# Altium schematic sheet Схема питания Velvet Controller.SchDoc
size A3; SheetNumber: 1; SheetTotal: 6
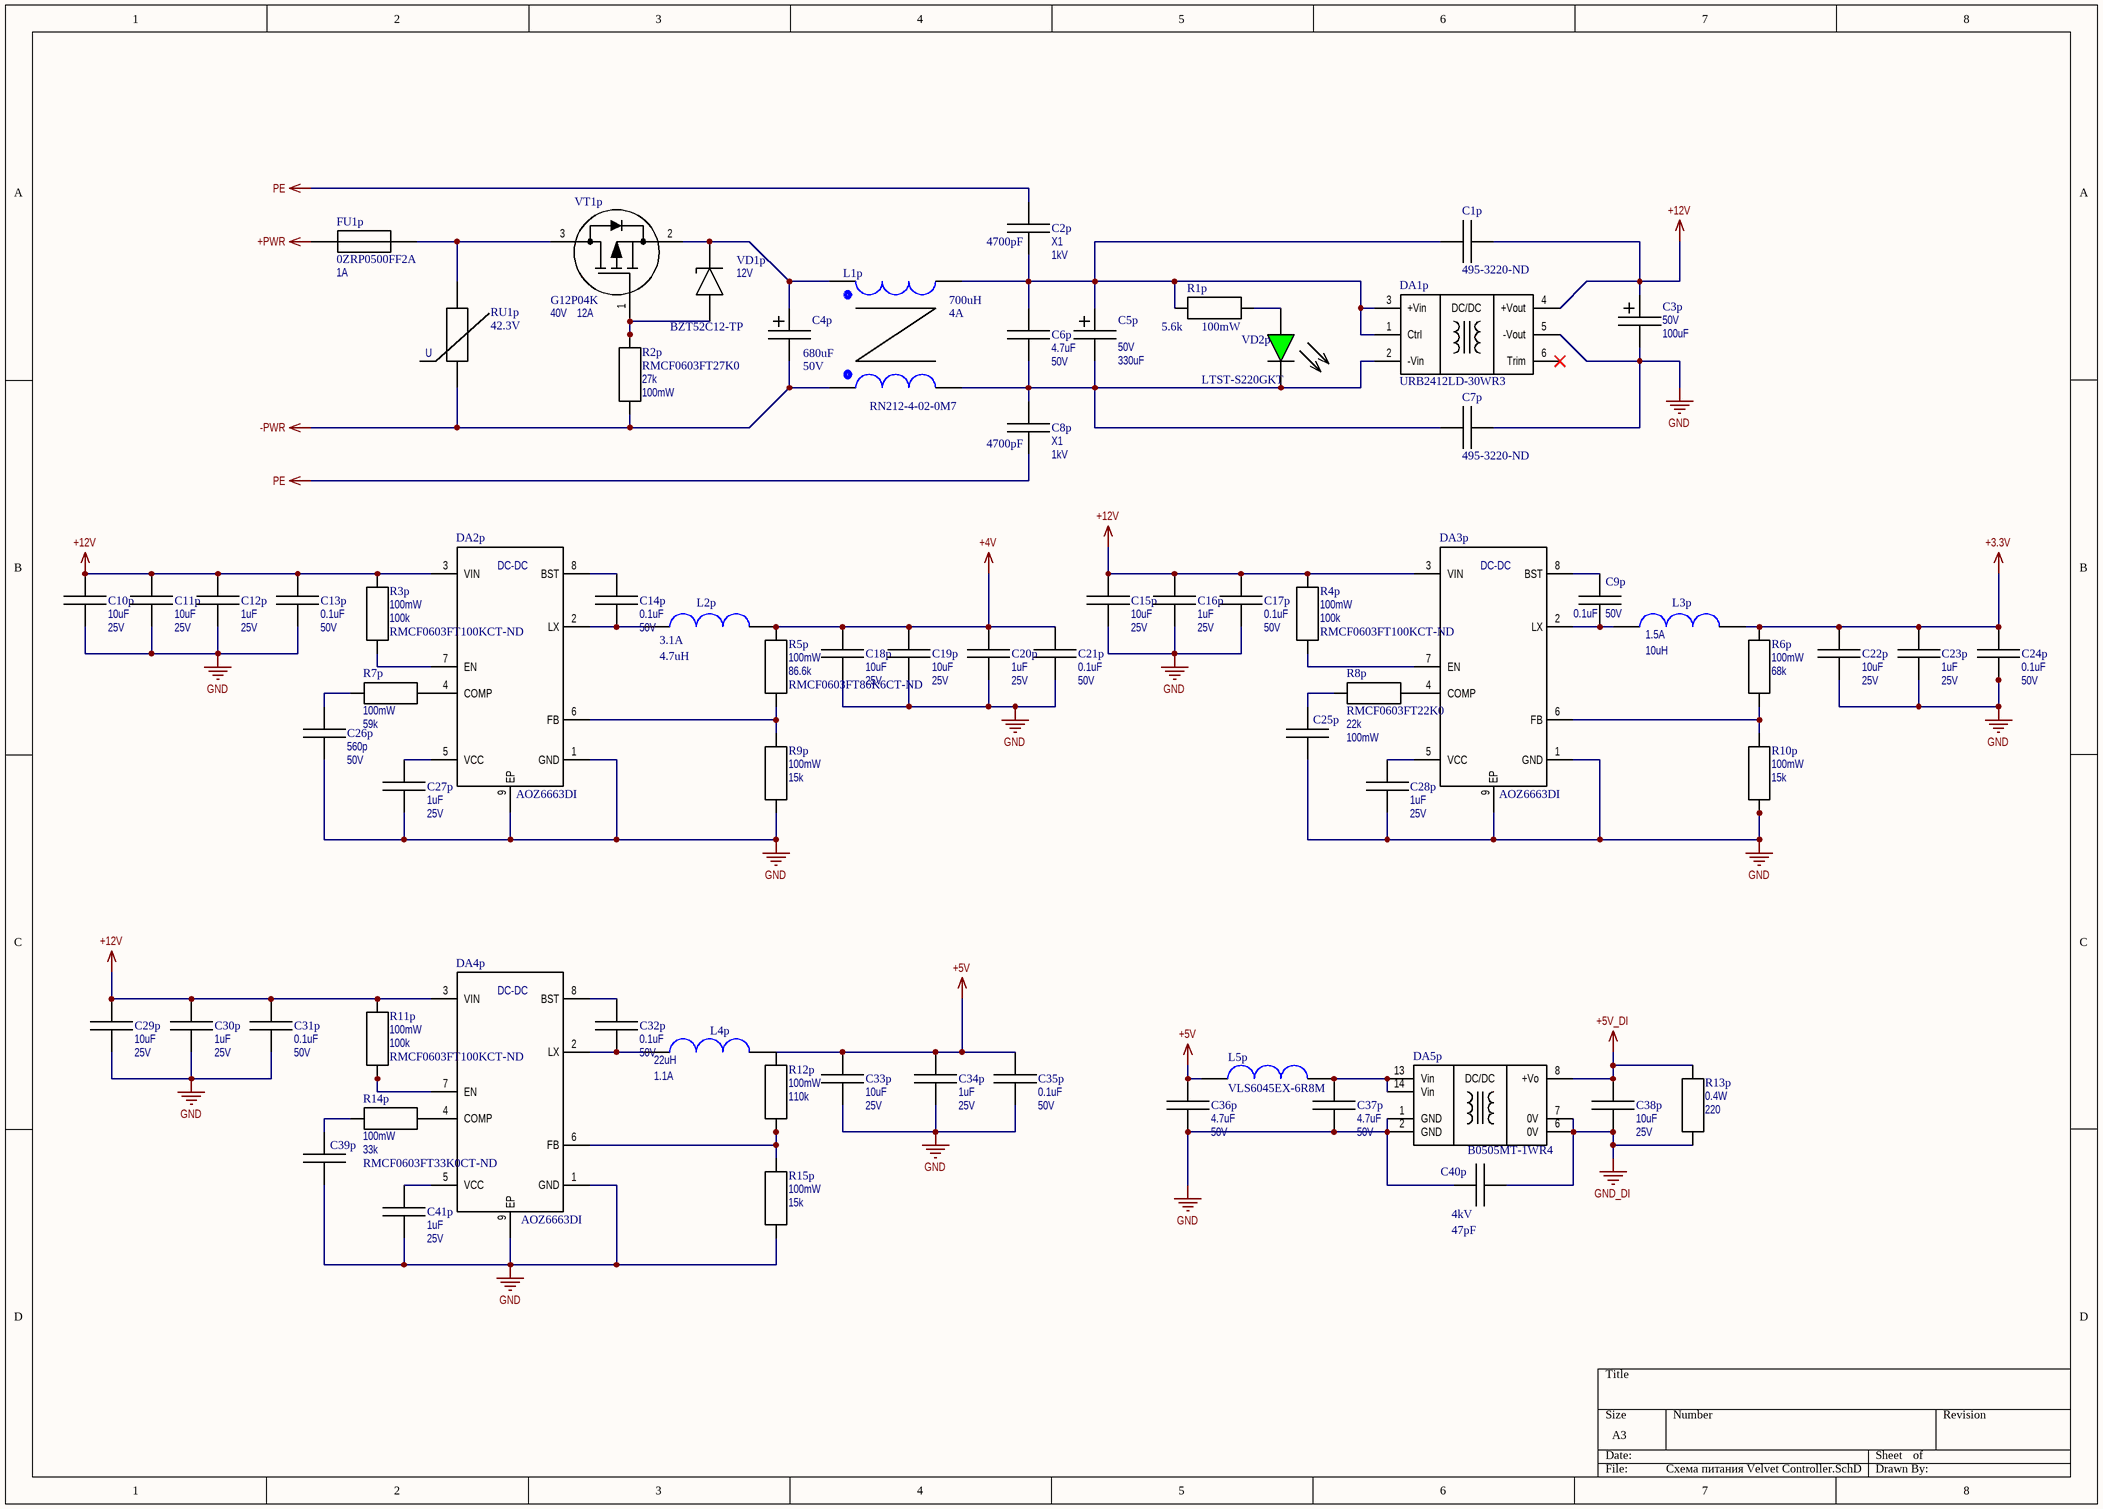
[diagram p0: Схема питания Velvet Controller.SchDoc]

## Parts
C1p  Supplier Part Number 1: 495-3220-ND  [CAP RADIAL L18.0 W5.0 H10.5 P15.0]  (hidden comment: B32672L8122J000)
C2p  Capacitance: 4700pF  Type: X1  Rated Voltage: 1kV  [CAP RADIAL L13.0 W4.0 H9.1 P10.0]  (hidden comment: R474F147050A1M)
C3p  Voltage Rated: 50V  Capacitance: 100uF  [CAP RADIAL D8.0 L12.0 P5.0]  (hidden comment: ECA-1HM101B)
C4p  Capacitance: 680uF  Voltage Rated: 50V  [CAP RADIAL D12.5 L20.0 P5.0]  (hidden comment: 50PX680MEFC12.5X20)
C5p  Voltage Rated: 50V  Capacitance: 330uF  [CAP RADIAL D10.0 L17,0 P5.0]  (hidden comment: ECA-1HM331B)
C6p  Capacitance: 4.7uF  Rated Voltage: 50V  [CAP 0805 IPC MAX]  (hidden comment: CL21A475KBQNNNE)
C7p  Supplier Part Number 1: 495-3220-ND  [CAP RADIAL L18.0 W5.0 H10.5 P15.0]  (hidden comment: B32672L8122J000)
C8p  Capacitance: 4700pF  Type: X1  Rated Voltage: 1kV  [CAP RADIAL L13.0 W4.0 H9.1 P10.0]  (hidden comment: R474F147050A1M)
C9p  Capacitance: 0.1uF  Rated Voltage: 50V  [CAP 0603 IPC MAX]  (hidden comment: GCM188R71H104KA57D)
C10p  Capacitance: 10uF  Rated Voltage: 25V  [CAP 1206 IPC MAX]  (hidden comment: CL31B106KAHNNNE)
C11p  Capacitance: 10uF  Rated Voltage: 25V  [CAP 1206 IPC MAX]  (hidden comment: CL31B106KAHNNNE)
C12p  Capacitance: 1uF  Rated Voltage: 25V  [CAP 0603 IPC MAX]  (hidden comment: TMK107BJ105KA-T)
C13p  Capacitance: 0.1uF  Rated Voltage: 50V  [CAP 0603 IPC MAX]  (hidden comment: GCM188R71H104KA57D)
C14p  Capacitance: 0.1uF  Rated Voltage: 50V  [CAP 0603 IPC MAX]  (hidden comment: GCM188R71H104KA57D)
C15p  Capacitance: 10uF  Rated Voltage: 25V  [CAP 1206 IPC MAX]  (hidden comment: CL31B106KAHNNNE)
C16p  Capacitance: 1uF  Rated Voltage: 25V  [CAP 0603 IPC MAX]  (hidden comment: TMK107BJ105KA-T)
C17p  Capacitance: 0.1uF  Rated Voltage: 50V  [CAP 0603 IPC MAX]  (hidden comment: GCM188R71H104KA57D)
C18p  Capacitance: 10uF  Rated Voltage: 25V  [CAP 1206 IPC MAX]  (hidden comment: CL31B106KAHNNNE)
C19p  Capacitance: 10uF  Rated Voltage: 25V  [CAP 1206 IPC MAX]  (hidden comment: CL31B106KAHNNNE)
C20p  Capacitance: 1uF  Rated Voltage: 25V  [CAP 0603 IPC MAX]  (hidden comment: TMK107BJ105KA-T)
C21p  Capacitance: 0.1uF  Rated Voltage: 50V  [CAP 0603 IPC MAX]  (hidden comment: GCM188R71H104KA57D)
C22p  Capacitance: 10uF  Rated Voltage: 25V  [CAP 1206 IPC MAX]  (hidden comment: CL31B106KAHNNNE)
C23p  Capacitance: 1uF  Rated Voltage: 25V  [CAP 0603 IPC MAX]  (hidden comment: TMK107BJ105KA-T)
C24p  Capacitance: 0.1uF  Rated Voltage: 50V  [CAP 0603 IPC MAX]  (hidden comment: GCM188R71H104KA57D)
C25p  CAP  [RES 0603 IPC MAX]  (value not drawn)
C26p  Capacitance: 560p  Rated Voltage: 50V  [CAP 0603 IPC MAX]  (hidden comment: CC0603KRX7R9BB561)
C27p  Capacitance: 1uF  Rated Voltage: 25V  [CAP 0603 IPC MAX]  (hidden comment: TMK107BJ105KA-T)
C28p  Capacitance: 1uF  Rated Voltage: 25V  [CAP 0603 IPC MAX]  (hidden comment: TMK107BJ105KA-T)
C29p  Capacitance: 10uF  Rated Voltage: 25V  [CAP 1206 IPC MAX]  (hidden comment: CL31B106KAHNNNE)
C30p  Capacitance: 1uF  Rated Voltage: 25V  [CAP 0603 IPC MAX]  (hidden comment: TMK107BJ105KA-T)
C31p  Capacitance: 0.1uF  Rated Voltage: 50V  [CAP 0603 IPC MAX]  (hidden comment: GCM188R71H104KA57D)
C32p  Capacitance: 0.1uF  Rated Voltage: 50V  [CAP 0603 IPC MAX]  (hidden comment: GCM188R71H104KA57D)
C33p  Capacitance: 10uF  Rated Voltage: 25V  [CAP 1206 IPC MAX]  (hidden comment: CL31B106KAHNNNE)
C34p  Capacitance: 1uF  Rated Voltage: 25V  [CAP 0603 IPC MAX]  (hidden comment: TMK107BJ105KA-T)
C35p  Capacitance: 0.1uF  Rated Voltage: 50V  [CAP 0603 IPC MAX]  (hidden comment: GCM188R71H104KA57D)
C36p  Capacitance: 4.7uF  Rated Voltage: 50V  [CAP 0805 IPC MAX]  (hidden comment: CL21A475KBQNNNE)
C37p  Capacitance: 4.7uF  Rated Voltage: 50V  [CAP 0805 IPC MAX]  (hidden comment: CL21A475KBQNNNE)
C38p  Capacitance: 10uF  Rated Voltage: 25V  [CAP 1206 IPC MAX]  (hidden comment: CL31B106KAHNNNE)
C39p  CAP  [RES 0603 IPC MAX]  (value not drawn)
C40p  Capacitance: 47pF  Rated Voltage: 4kV  [CC45SL3JD470JYVNA]  (hidden comment: CC45SL3JD470JYVNA)
C41p  Capacitance: 1uF  Rated Voltage: 25V  [CAP 0603 IPC MAX]  (hidden comment: TMK107BJ105KA-T)
DA1p  URB2412LD-30WR3  [URB2412LD-30WR3]
DA2p  AOZ6663DI  [DFN 3x3-8L]
DA3p  AOZ6663DI  [DFN 3x3-8L]
DA4p  AOZ6663DI  [DFN 3x3-8L]
DA5p  B0505MT-1WR4  [B0505MT-1WR4]
FU1p  0ZRP0500FF2A  Current Hold: 1A  [0ZRP0500FF2A]
L1p  RN212-4-02-0M7  Inductance: 700uH  Current Rating: 4A  [FIXED IND RN212-4-02-0M7]
L2p  Inductance: 4.7uH  Current Rating: 3.1A  [SRN5040]  (hidden comment: SRN5040-4R7M)
L3p  Inductance: 10uH  Current Rating: 1.5A  [ASPI-4030S]  (hidden comment: ASPI-4030S-100M-T)
L4p  Inductance: 22uH  Current Rating: 1.1A  [TYS5020]  (hidden comment: TYS5020220M-10)
L5p  VLS6045EX-6R8M  [VLS6045EX]
R1p  Resistance: 5.6k  Rated Power: 100mW  [RES 0603 IPC MAX]  (hidden comment: RMCF0603FT5K60)
R2p  RMCF0603FT27K0  Resistance: 27k  Rated Power: 100mW  [RES 0603 IPC MAX]
R3p  Power Rated: 100mW  Resistance: 100k  Supplier Part Number 1: RMCF0603FT100KCT-ND  [RES 0603 IPC MAX]  (hidden comment: RMCF0603FT100K)
R4p  Power Rated: 100mW  Resistance: 100k  Supplier Part Number 1: RMCF0603FT100KCT-ND  [RES 0603 IPC MAX]  (hidden comment: RMCF0603FT100K)
R5p  Power Rated: 100mW  Resistance: 86.6k  Supplier Part Number 1: RMCF0603FT86K6CT-ND  [RES 0603 IPC MAX]  (hidden comment: RMCF0603FT86K6)
R6p  Power Rated: 100mW  Resistance: 68k  [RES 0603 IPC MAX]  (hidden comment: RMCF0603FT68K0)
R7p  Power Rated: 100mW  Resistance: 59k  [RES 0603 IPC MAX]  (hidden comment: RMCF0603FT59K0)
R8p  RMCF0603FT22K0  Resistance: 22k  Power Rated: 100mW  [RES 0603 IPC MAX]
R9p  Power Rated: 100mW  Resistance: 15k  [RES 0603 IPC MAX]  (hidden comment: RMCF0603FT15K0)
R10p  Power Rated: 100mW  Resistance: 15k  [RES 0603 IPC MAX]  (hidden comment: RMCF0603FT15K0)
R11p  Power Rated: 100mW  Resistance: 100k  Supplier Part Number 1: RMCF0603FT100KCT-ND  [RES 0603 IPC MAX]  (hidden comment: RMCF0603FT100K)
R12p  Power Rated: 100mW  Resistance: 110k  [RES 0603 IPC MAX]  (hidden comment: RMCF0603FT110K)
R13p  Power Rated: 0.4W  Resistance: 220  [RES 0805 IPC MAX]  (hidden comment: ESR10EZPF2200)
R14p  Power Rated: 100mW  Resistance: 33k  Supplier Part Number 1: RMCF0603FT33K0CT-ND  [RES 0603 IPC MAX]  (hidden comment: RMCF0603FT33K0)
R15p  Power Rated: 100mW  Resistance: 15k  [RES 0603 IPC MAX]  (hidden comment: RMCF0603FT15K0)
RU1p  Varistor Voltage (Min): 42.3V  [B72220S0300K101]  (hidden comment: B72220S0300K101)
VD1p  BZT52C12-TP  Zener Voltage: 12V  [SOD-123 (Marked)]
VD2p  LTST-S220GKT  [0805 DIODE]
VT1p  G12P04K  Vds Max: 40V  Max Drain Current: 12A  [TO-252 (D-PAK)]

## Nets
+3.3V: C22p.1 C23p.1 C24p.1 L3p.2 R6p.1
+4V: C18p.1 C19p.1 C20p.1 C21p.1 L2p.2 R5p.1
+5V: C33p.1 C34p.1 C35p.1 C36p.1 L4p.2 L5p.1 R12p.2
+5V_DI: C38p.1 DA5p.8(+Vo) R13p.2
+12V: C1p.2 C3p.1 C10p.1 C11p.1 C12p.1 C13p.1 C15p.1 C16p.1 C17p.1 C29p.1 C30p.1 C31p.1 DA1p.4(+Vout) DA2p.3(VIN) DA3p.3(VIN) DA4p.3(VIN) R3p.2 R4p.1 R11p.1
+PWR: FU1p.1
-PWR: C4p.2 L1p.3 R2p.1 RU1p.1
GND: C3p.2 C7p.2 C10p.2 C11p.2 C12p.2 C13p.2 C15p.2 C16p.2 C17p.2 C18p.2 C19p.2 C20p.2 C21p.2 C22p.2 C23p.2 C24p.2 C25p.2 C26p.2 C27p.2 C28p.2 C29p.2 C30p.2 C31p.2 C33p.2 C34p.2 C35p.2 C36p.2 C37p.2 C39p.2 C40p.1 C41p.2 DA1p.5(-Vout) DA2p.1(GND) DA2p.9(EP) DA3p.1(GND) DA3p.9(EP) DA4p.1(GND) DA4p.9(EP) DA5p.1(GND) DA5p.2(GND) R9p.1 R10p.1 R15p.1
GND_DI: C38p.2 C40p.2 DA5p.6(0V) DA5p.7(0V) R13p.1
PE: C2p.1 C8p.2
NetC1p_1: C1p.1 C2p.2 C5p.1 C6p.1 DA1p.1(Ctrl) DA1p.3(+Vin) L1p.2 R1p.1
NetC4p_1: C4p.1 L1p.1 VD1p.1 VT1p.2(S)
NetC5p_2: C5p.2 C6p.2 C7p.1 C8p.1 DA1p.2(-Vin) L1p.4 VD2p.2
NetC9p_1: C9p.1 DA3p.8(BST)
NetC9p_2: C9p.2 DA3p.2(LX) L3p.1
NetC14p_1: C14p.1 DA2p.8(BST)
NetC14p_2: C14p.2 DA2p.2(LX) L2p.1
NetC25p_1: C25p.1 R8p.1
NetC26p_1: C26p.1 R7p.1
NetC27p_1: C27p.1 DA2p.5(VCC)
NetC28p_1: C28p.1 DA3p.5(VCC)
NetC32p_1: C32p.1 DA4p.8(BST)
NetC32p_2: C32p.2 DA4p.2(LX) L4p.1
NetC37p_1: C37p.1 DA5p.13(Vin) DA5p.14(Vin) L5p.2
NetC39p_1: C39p.1 R14p.2
NetC41p_1: C41p.1 DA4p.5(VCC)
NetDA2p_4: DA2p.4(COMP) R7p.2
NetDA2p_6: DA2p.6(FB) R5p.2 R9p.2
NetDA2p_7: DA2p.7(EN) R3p.1
NetDA3p_4: DA3p.4(COMP) R8p.2
NetDA3p_6: DA3p.6(FB) R6p.2 R10p.2
NetDA3p_7: DA3p.7(EN) R4p.2
NetDA4p_4: DA4p.4(COMP) R14p.1
NetDA4p_6: DA4p.6(FB) R12p.1 R15p.2
NetDA4p_7: DA4p.7(EN) R11p.2
NetFU1p_2: FU1p.2 RU1p.2 VT1p.3(D)
NetR1p_2: R1p.2 VD2p.1
NetR2p_2: R2p.2 VD1p.2 VT1p.1(G)

Not connected (* = marked no-connect by the designer): DA1p 6(Trim)*

## Notes on the sheet
- (in symbol AOZ6663DI) DC-DC
- (in symbol B0505MT-1WR4) DC/DC
- (in symbol B72220S0300K101) U
- (in symbol URB2412LD-30WR3) DC/DC

## Library data of the parts
C1p C7p = B32672L8122J000: CAP FILM 1200PF 5% 2KVDC RADIAL; Manufacturer 1: EPCOS - TDK Electronics; Rated Voltage: 2kV; Type: MKP; Manufacturer Part Number 1: B32672L8122J000; Min Operating Temperature: -55°C; Max Operating Temperature: 110°C; Capacitance: 1200pF; Tolerance: 5%; Mounting: T/H; Package: 18mm x 5mm x 10.5mm; Lead Spacing: 15mm; Supplier 1: Digi-Key
C2p C8p = R474F147050A1M: CAP FILM 4700PF 20% 1KVDC RAD; Manufacturer 1: KEMET; Manufacturer Part Number 1: R474F147050A1M; Min Operating Temperature: -40°C; Max Operating Temperature: 110°C; Tolerance: 20%; Mounting: T/H; Package: 13mm x 4mm x 9.1mm; Lead Spacing: 10mm; Supplier 1: Digi-Key; Supplier Part Number 1: 399-13727-ND
C3p = ECA-1HM101B: CAP ALUM 100UF 20% 50V RADIAL; Manufacturer 1: Panasonic Electronic Components; Capacitor Type: Aluminium Electrolytic; Ripple Current @ Low Frequency: 250mA; Ripple Current @ High Frequency: 425mA; Manufacturer Part Number 1: ECA-1HM101B; Min Operating Temperature: -40°C; Max Operating Temperature: 85°C; Lead Spacing: 5mm; Diameter: 8mm; Height: 12.5mm; Tolerance: 20%; Supplier 1: Digi-Key; Supplier Part Number 1: P5182-ND
C4p = 50PX680MEFC12.5X20: CAP ALUM 680UF 20% 50V RADIAL; Manufacturer 1: Rubycon; Capacitor Type: Aluminium Electrolytic; Ripple Current @ Low Frequency: 980mA; Ripple Current @ High Frequency: 1.176A; Manufacturer Part Number 1: 50PX680MEFC12.5X20; Min Operating Temperature: -55°C; Max Operating Temperature: 105°C; Lead Spacing: 5mm; Diameter: 12.5mm; Height: 21.5mm; Tolerance: 20%
C5p = ECA-1HM331B: CAP ALUM 330UF 20% 50V RADIAL; Manufacturer 1: Panasonic Electronic Components; Capacitor Type: Aluminium Electrolytic; Ripple Current @ Low Frequency: 500mA; Ripple Current @ High Frequency: 850A; Manufacturer Part Number 1: ECA-1HM331B; Min Operating Temperature: -40°C; Max Operating Temperature: 85°C; Lead Spacing: 5mm; Diameter: 10mm; Height: 17mm; Tolerance: 20%
C6p C36p C37p = CL21A475KBQNNNE: CAP SMD CER 4.7UF 50V X5R 0805; Manufacturer 1: Samsung Electro-Mechanics; Tolerance: 10%; Type: Multilayer Ceramic; Manufacturer Part Number 1: CL21A475KBQNNNE; Min Operating Temperature: -55°C; Max Operating Temperature: 85°C; Mounting: SM; Package: 0805; Supplier 1: Digi-Key; Supplier Part Number 1: 1276-1248-1-ND
C9p C13p C14p C17p C21p C24p C31p C32p C35p = GCM188R71H104KA57D: CAP SMD CER 0.1UF 50V X7R 0603; Manufacturer 1: Murata Electronics; Tolerance: 10%; Type: Multilayer Ceramic; Manufacturer Part Number 1: GCM188R71H104KA57D; Min Operating Temperature: -55°C; Max Operating Temperature: 125°C; Mounting: SM; Package: 0603; Supplier 1: Digi-Key; Supplier Part Number 1: 490-4779-1-ND
C10p C11p C15p C18p C19p C22p C29p C33p C38p = CL31B106KAHNNNE: CAP SMD CER 10UF 25V X7R 1206; Manufacturer 1: Samsung Electro-Mechanics; Tolerance: 10%; Type: Multilayer Ceramic; Manufacturer Part Number 1: CL31B106KAHNNNE; Min Operating Temperature: -55°C; Max Operating Temperature: 125°C; Mounting: SM; Package: 1206; Supplier 1: Digi-Key; Supplier Part Number 1: 1276-1804-1-ND
C12p C16p C20p C23p C27p C28p C30p C34p C41p = TMK107BJ105KA-T: CAP SMD CER 1UF 25V X5R 0603; Manufacturer 1: Taiyo Yuden; Tolerance: 10%; Type: Multilayer Ceramic; Manufacturer Part Number 1: TMK107BJ105KA-T; Min Operating Temperature: -55°C; Max Operating Temperature: 85°C; Mounting: SM; Package: 0603; Supplier 1: Digi-Key; Supplier Part Number 1: 587-1248-1-ND
C25p C39p = CAP GOST: CAP ??UF ??% ??V Package?
C26p = CC0603KRX7R9BB561: CAP SMD CER 560PF 50V X7R 0603; Manufacturer 1: YAGEO; Tolerance: 10%; Type: Multilayer Ceramic; Manufacturer Part Number 1: CC0603KRX7R9BB561; Min Operating Temperature: -55°C; Max Operating Temperature: 125°C; Mounting: SM; Package: 0603; Supplier 1: Digi-Key; Supplier Part Number 1: 311-1079-1-ND
C40p = CC45SL3JD470JYVNA: CAP SMD CER 47PF 6KV SL RADIAL; Manufacturer 1: TDK Corporation; Tolerance: 5%; Type: High Voltage; Manufacturer Part Number 1: CC45SL3JD470JYVNA; Min Operating Temperature: -25°C; Max Operating Temperature: 125°C; Mounting: T/H; Package: Radial
DA1p = URB2412LD-30WR3: DC DC CONVERTER 12V 30W; Max Input Voltage DC: 36V; Min Input Voltage DC: 9V; Max Output Current: 2.5A; Efficiency: 90%; Output Voltage Ripple: 100mV; Operating Frequency: 300kHz; Output Voltage DC: 12V; Power Rating: 30W; Application: ITE (Commercial); Min Operating Temperature: +80℃; Max Operating Temperature: -40℃; Mounting Type: T/H; Pins: 6; Size: 50.8mm x 25.4mm x 11.8mm; Help URL: https://www.mornsun-power.com/html/pdf/URB2412LD-30WR3.html; Supplier 1: Digi-Key; Supplier Part Number 1: 2725-URB2412LD-30WR3-ND
DA2p DA3p DA4p = AOZ6663DI: IC REG BUCK ADJ 3A 8DFN; Manufacturer 1: Alpha & Omega Semiconductor Inc.; Min Input Voltage: 4.5V; Max Input Voltage: 20V; Min Output Voltage: 0.6V; Max Output Voltage: 7V; Max Operating Frequency: 750kHz; Max Pulsed Current: 3.2A; Supplier 1: Digi-Key; Supplier Part Number 1: 785-1855-1-ND; Manufacturer Part Nubmer 1: AOZ6663DI; Type: Buck
DA5p = B0505MT-1WR4: DC DC CONVERTER 5V 1W; Max Input Voltage DC: 5.5V; Min Input Voltage DC: 4.5V; Max Output Current: 200mA; Efficiency: 8%; Output Voltage Ripple: 100mV; Operating Frequency: 300kHz; Output Voltage DC: 5V; Power Rating: 1W; Application: ITE (Commercial); Min Operating Temperature: +125℃; Max Operating Temperature: -40℃; Mounting Type: SM; Pins: 7; Size: L9.0W7.0H3.1P1.27; Help URL: https://www.mornsun-power.com/html/pdf/B0505MT-1WR4.html; Supplier 1: Digi-Key; Supplier Part Number 1: 2725-B0505MT-1WR4CT-ND
FU1p = 0ZRP0500FF2A: PTC RESET FUSE 60V 5A RADIAL; Manufacturer 1: Bel Fuse Inc.; Current Trip: 10A; Time To Trip: 28s; Initial Resistance: 12mOhm; Max Current: 40A; Min Operating Temperature: -40°C; Max Operating Temperature: 85°C; Manufacturer Part Number 1: 0ZRP0500FF2A; Supplier 1: Digi-Key; Supplier Part Number 1: 507-0ZRP0500FF2ACT-ND
L1p = RN212-4-02-0M7: COMMON MODE CHOKE 700UH 4A 2LN TH; Manufacturer 1: Schaffner EMC Inc.; Shielding: Yes; DCR: 24mOhm; Manufacturer Part Number 1: RN212-4-02-0M7; Saturation Current: -; Min Operating Temperature: -40°C; Max Operating Temperature: 125°C; Supplier 1: Digi-Key; Supplier Part Number 1: 817-2176-ND
L2p = SRN5040-4R7M: FIXED IND 4.7UH 3.1A 35 MOHM SMD; Manufacturer 1: Bourns; Saturation Current: 3.3A; Shielding: Yes; DCR: 35mOhm; Manufacturer Part Number 1: SRN5040-4R7M; Min Operating Temperature: -40°C; Max Operating Temperature: 125°C; Supplier 1: Digi-Key; Supplier Part Number 1: SRN5040-4R7MCT-ND
L3p = ASPI-4030S-100M-T: FIXED IND 10UH 1.5A 100 MOHM SMD; Manufacturer 1: Abracon LLC; Saturation Current: 1.95A; Shielding: Yes; Manufacturer Part Number 1: ASPI-4030S-100M-T; DCR: 100mOhm; Min Operating Temperature: -40°C; Max Operating Temperature: 125°C; Supplier 1: Digi-Key; Supplier Part Number 1: 535-12314-1-ND
L4p = TYS5020220M-10: FIXED IND 22UH 1.1A 226 MOHM SMD; Manufacturer 1: Laird-Signal Integrity Products; Saturation Current: 1.15A; Shielding: Yes; Manufacturer Part Number 1: TYS5020220M-10; DCR: 226mOhm; Min Operating Temperature: -40°C; Max Operating Temperature: 125°C; Supplier 1: Digi-Key; Supplier Part Number 1: 240-2706-1-ND
L5p = VLS6045EX-6R8M: FIXED IND 6.8UH 3.6A 36 MOHM SMD; Manufacturer 1: TDK Corporation; Saturation Current: 4.7A; Shielding: Yes; DCR: 36mOhm; Manufacturer Part Number 1: VLS6045EX-6R8M; Inductance: 6.8uH; Current Rating: 3.6A; Min Operating Temperature: -40°C; Max Operating Temperature: 105°C; Supplier 1: Digi-Key; Supplier Part Number 1: 445-173057-1-ND
R1p = RMCF0603FT5K60: RES SMD 5.6K OHM 1% 1/10W 0603; Manufacturer Part Number 1: RMCF0603FT1K00; Manufacturer 1: Stackpole Electronics Inc; Rated Voltage: 75V; Qualification: AEC-Q200; Tolerance: 1%; Package: 0603; Min Operating Temperature: -55°C; Max Operating Temperature: 155°C
R2p = RMCF0603FT27K0: RES SMD 27K OHM 1% 1/10W 0603; Manufacturer 1: Stackpole Electronics Inc; Manufacturer Part Number 1: RMCF0603FT22K0; Rated Voltage: 75V; Max Operating Temperature: 155°C; Min Operating Temperature: -55°C; Tolerance: 1%; Package: 0603; Mounting: SM; Pins: 2; Ratings: AEC-Q200; Supplier 1: Digi-Key; Supplier Part Number 1: RMCF0603FT27K0CT-ND
R3p R4p R11p = RMCF0603FT100K: RES SMD 100K OHM 5% 1/10W 0603; Manufacturer 1: Stackpole Electronics Inc; Voltage Rated: 75V; Manufacturer Part Number 1: RMCF0603FT100K; Min Operating Temperature: -55°C; Max Operating Temperature: 155°C; Tolerance: 5%; Package: 0603; Ratings: AEC-Q200; Supplier 1: Digi-Key
R5p = RMCF0603FT86K6: RES SMD 86.6K OHM 5% 1/10W 0603; Manufacturer 1: Stackpole Electronics Inc; Voltage Rated: 75V; Manufacturer Part Number 1: RMCF0603FT86K6; Min Operating Temperature: -55°C; Max Operating Temperature: 155°C; Tolerance: 5%; Package: 0603; Ratings: AEC-Q200; Supplier 1: Digi-Key
R6p = RMCF0603FT68K0: RES SMD 68K OHM 1% 1/10W 0603; Manufacturer 1: Stackpole Electronics Inc; Voltage Rated: 75V; Manufacturer Part Number 1: RMCF0603FT68K0; Min Operating Temperature: -55°C; Max Operating Temperature: 155°C; Tolerance: 1%; Package: 0603; Ratings: AEC-Q200; Supplier 1: Digi-Key; Supplier Part Number 1: RMCF0603FT68K0CT-ND
R7p = RMCF0603FT59K0: RES SMD 59K OHM 5% 1/10W 0603; Manufacturer 1: Stackpole Electronics Inc; Voltage Rated: 75V; Manufacturer Part Number 1: RMCF0603FT59K0; Min Operating Temperature: -55°C; Max Operating Temperature: 155°C; Tolerance: 5%; Package: 0603; Ratings: AEC-Q200; Supplier 1: Digi-Key; Supplier Part Number 1: RMCF0603FT59K0CT-ND
R8p = RMCF0603FT22K0: RES SMD 22K OHM 1% 1/10W 0603; Manufacturer 1: Stackpole Electronics Inc; Min Operating Temnperature: -55°C; Voltage Rated: 75V; Manufacturer Part Number 1: RMCF0603FT22K0; Max Operating Temperature: 155°C; Tolerance: 1%; Package: 0603; Mounting: SM; Pins: 2; Rating: AEC-Q200; Supplier 1: Digi-Key; Supplier Part Number 1: RMCF0603FT22K0CT-ND
R9p R10p R15p = RMCF0603FT15K0: RES SMD 15K OHM 1% 1/10W 0603; Manufacturer 1: Stackpole Electronics Inc; Voltage Rated: 75V; Manufacturer Part Number 1: RMCF0603FT15K0; Min Operating Temperature: -55°C; Max Operating Temperature: 155°C; Tolerance: 1%; Package: 0603; Ratings: AEC-Q200; Supplier 1: Digi-Key; Supplier Part Number 1: RMCF0603FT15K0CT-ND
R12p = RMCF0603FT110K: RES SMD 110K OHM 1% 1/10W 0603; Manufacturer 1: Stackpole Electronics Inc; Voltage Rated: 75V; Tolerance: 5%; Manufacturer Part Number 1: RMCF0603FT110K; Min Operating Temperature: -55°C; Max Operating Temperature: 155°C; Package: 0603; Ratings: AEC-Q200; Supplier 1: Digi-Key; Supplier Part Number 1: RMCF0603FT110KCT-ND
R13p = ESR10EZPF2200: RES SMD 220 OHM 1% 0.4W 0805; Manufacturer 1: Rohm Semiconductor; Voltage Rated: 100V; Manufacturer Part Number 1: ESR10EZPF2200; Min Operating Temperature: -55°C; Max Operating Temperature: 155°C; Tolerance: 1%; Package: 0805; Ratings: AEC-Q200; Supplier 1: Digi-Key; Supplier Part Number 1: RHM220AECT-ND
R14p = RMCF0603FT33K0: RES SMD 33K OHM 1% 1/10W 0603; Manufacturer 1: Stackpole Electronics Inc; Voltage Rated: 75V; Manufacturer Part Number 1: RMCF0603FT33K0; Min Operating Temperature: -55°C; Max Operating Temperature: 155°C; Tolerance: 1%; Package: 0603; Ratings: AEC-Q200; Supplier 1: Digi-Key
RU1p = B72220S0300K101: VARISTOR 47V 2KA DISC 20MM S20K30; Manufacturer: EPCOS Inc; Number of Circuits: 1; Maximum AC Volts: 30V; Maximum DC Volts: 38W; Energy: 26J; Manufacturer Part Number: B72220S0300K101; RoHS Compliant: Yes; Current - Surge: 2kA; Package / Case: Disc 20mm; ComponentLink1URL: https://www.tdk-electronics.tdk.com/inf/70/db/var/SIOV_Leaded_StandarD.pdf?ref_disty=digikey; ComponentLink1Description: Datasheet; Supplier 1: Digi-Key; Supplier Part Number 1: 495-2405-ND
VD1p = BZT52C12-TP: DIODE ZENER 12V 200MW SOD123; Manufacturer 1: Micro Commercial Co; Tolerance: 5%; Max Impedance: 28 Ohm; Reverse Current: 100nA; Manufacturer Part Number 1: BZT52C12-TP; Min Operating Temperature: -65°C; Max Operating Temperature: 150°C; Max Power: 200mW; Package: SOD-123; Mounting: SM; Supplier 1: Digi-Key; Supplier Part Number 1: BZT52C12-TPMSCT-ND
VD2p = LTST-S220GKT: LED GREEN CLEAR SMD R/A; Manufacturer 1: Lite-On Inc.; Max Continious Current: 30mA; Max Pulse Current: 120mA; Reverse Voltage: 5V; Power Dissipation: 100mW; Forward Voltage: 2.2V; Manufacturer Part Number 1: LTST-S220GKT; Max Operating Temperature: +85°C; Package: 0805
VT1p = G12P04K: MOSFET P-CH 40V 12A TO-252; Manufacturer 1: Goford Semiconductor; Type: P-Chanel; Rds On (Max): 35mOhm; Vth: 2.5V; Gate Charge: 25nC; Vgs Max: 20V; Input Capacitance: 930pF; Max Power Dissipation: 50W; Min Operating Temperature: -55°C; Max Operating Temperature: 150°C; Mounting Type: SM; Package: TO-252; Manufacturer Part Number 1: G12P04K; Supplier 1: Digi-Key; Supplier Part Number 1: 3141-G12P04KCT-ND